# EAGLE schematic Color Light Sensor Board (EAGLE 8.1.0)
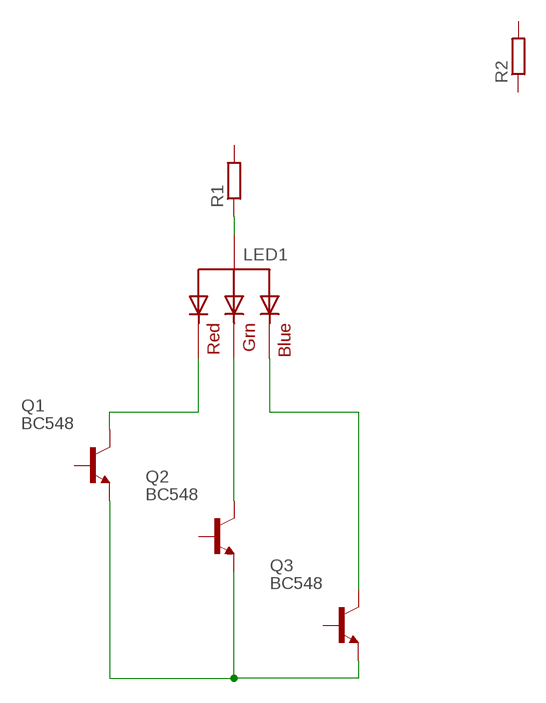
[diagram p0: schematic, sheet 1]

## Parts
LED1  RGBLED_CA-5MM  [LED5MMRGB]
Q1  BC548  [TO92-EBC]
Q2  BC548  [TO92-EBC]
Q3  BC548  [TO92-EBC]
R1  R-EU_0204/7  [0204/7]
R2  R-EU_0204/2V  [0204V]

## Nets
N$1: LED1.1(RED) Q1.C
N$2: LED1.3(GREEN) Q2.C
N$3: LED1.4(BLUE) Q3.C
N$4: LED1.2(VCC) R1.1
N$6: Q1.E Q2.E Q3.E
Unconnected: Q1.B Q2.B Q3.B R1.2 R2.1 R2.2

## Library data of the parts
LED1 = adafruit:RGBLED_CA: RGB LED, common-anode 5MM Staggered pins 5mm Piranha package http://www.ladyada.net/library/pcb/eaglelibrary.html
Q1-Q3 = transistor-npn:BC548*: NPN Transistor
R1 = rcl:R-EU_: RESISTOR, European symbol
R2 = resistor:R-EU_: RESISTOR, European symbol